# Altium schematic sheet GD_Tcontroller_Power.SchDoc
size A4
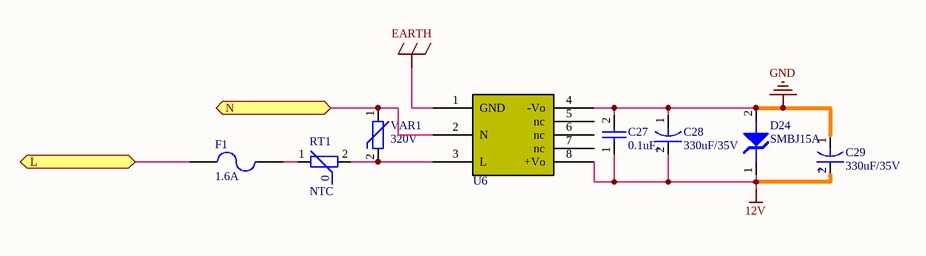
[diagram p0: GD_Tcontroller_Power.SchDoc]

## Parts
C27  value 0.1uF  [C0805]  (hidden comment: CAP)
C28  value 330uF/35V  [CA10X16P5]  (hidden comment: CAPACITOR)
C29  value 330uF/35V  [CA10X16P5]  (hidden comment: CAPACITOR)
D24  SMBJ15A  [SMB]
F1  value 1.6A  [392XXXX000]  (hidden comment: Fuse)
RT1  NTC  [NTC8_5x6P5]
U6  LH05-10B12  [LH05X]  (value not drawn)
VAR1  value 320V  [VAR16_7X6_6P7_5]  (hidden comment: VARISTOR)

## Ports
L, N

## Nets
12V: C27.1 C28.2 C29.2 D24.1 U6.8(+Vo)
EARTH: U6.1(GND)
GND: C27.2 C28.1 C29.1 D24.2 U6.4(-Vo)
L: F1.1 ; port L
N: U6.2(N) VAR1.1 ; port N
NetF1_2: F1.2 RT1.1
NetRT1_2: RT1.2 U6.3(L) VAR1.2

Not connected (* = marked no-connect by the designer): U6 5(nc) 6(nc) 7(nc)

## Notes on the sheet
- (in symbol EC00095) +
- (in symbol EF00003) 0

## Library data of the parts
C27 = EC00014: CAP SMD CR X7R 50V 10% 0.1uF 0805 ROHS; Manufacturer: YAGEO; Manufacturer P/N: CC0805KRX7R9BB104; ID: 14; HelpURL: *; P/N: EC00014
C28 C29 = EC00095: CAP 35V 20% 330uF 10X16X0.6MM ROHS，7000hours; Manufacturer: NIPPON CHEMI-CON; Manufacturer P/N: EKY350ELL331MJ16S; ID: 95; Type: ****; HelpURL: \\192.168.1.3\Esh\Department\RD\CAD\Component\Capacitor\KY(105).pdf; P/N: EC00095
D24 = ED00032: Manufacturer: Bourns; P/N: EE00002; Type: ****; Manufacturer P/N: SMBJ15A; Value: SMBJ15A
F1 = EF00005: FUSE,Ceramic,1.6A,25A@250VAC,8.5x8mm,ROHS; Manufacturer: LITTELFUSE; Manufacturer P/N: 39211600440; ID: 5; Type: ****; HelpURL: \\192.168.1.3\Esh\Department\RD\CAD\Component\Fuse\Ltitelfuse_Fuse_392.pdf; P/N: EF00005
RT1 = EF00003: Manufacturer P/N: 5D2-08LD; Manufacturer: SEMITEC; P/N: EE00003; Value: 5 Ohm  3A
U6 = LH05-10B05: Manufacturer: Mornsun; P/N: EE00001; Manufacturer P/N: LH05-10B05
VAR1 = ER00200: MOV 320V 14MM 80J LDFR ROHS; Manufacturer: LITTELFUSE; Manufacturer P/N: V320LA20AP; ID: 200; HelpURL: \\192.168.1.3\Esh\Department\RD\CAD\Component\Resistor\Varistor\Littelfuse_MOV_LA.pdf; P/N: ER00200; Type: ****